# Altium schematic sheet CHARGER.SchDoc
size A4; SheetNumber: 4; SheetTotal: 7
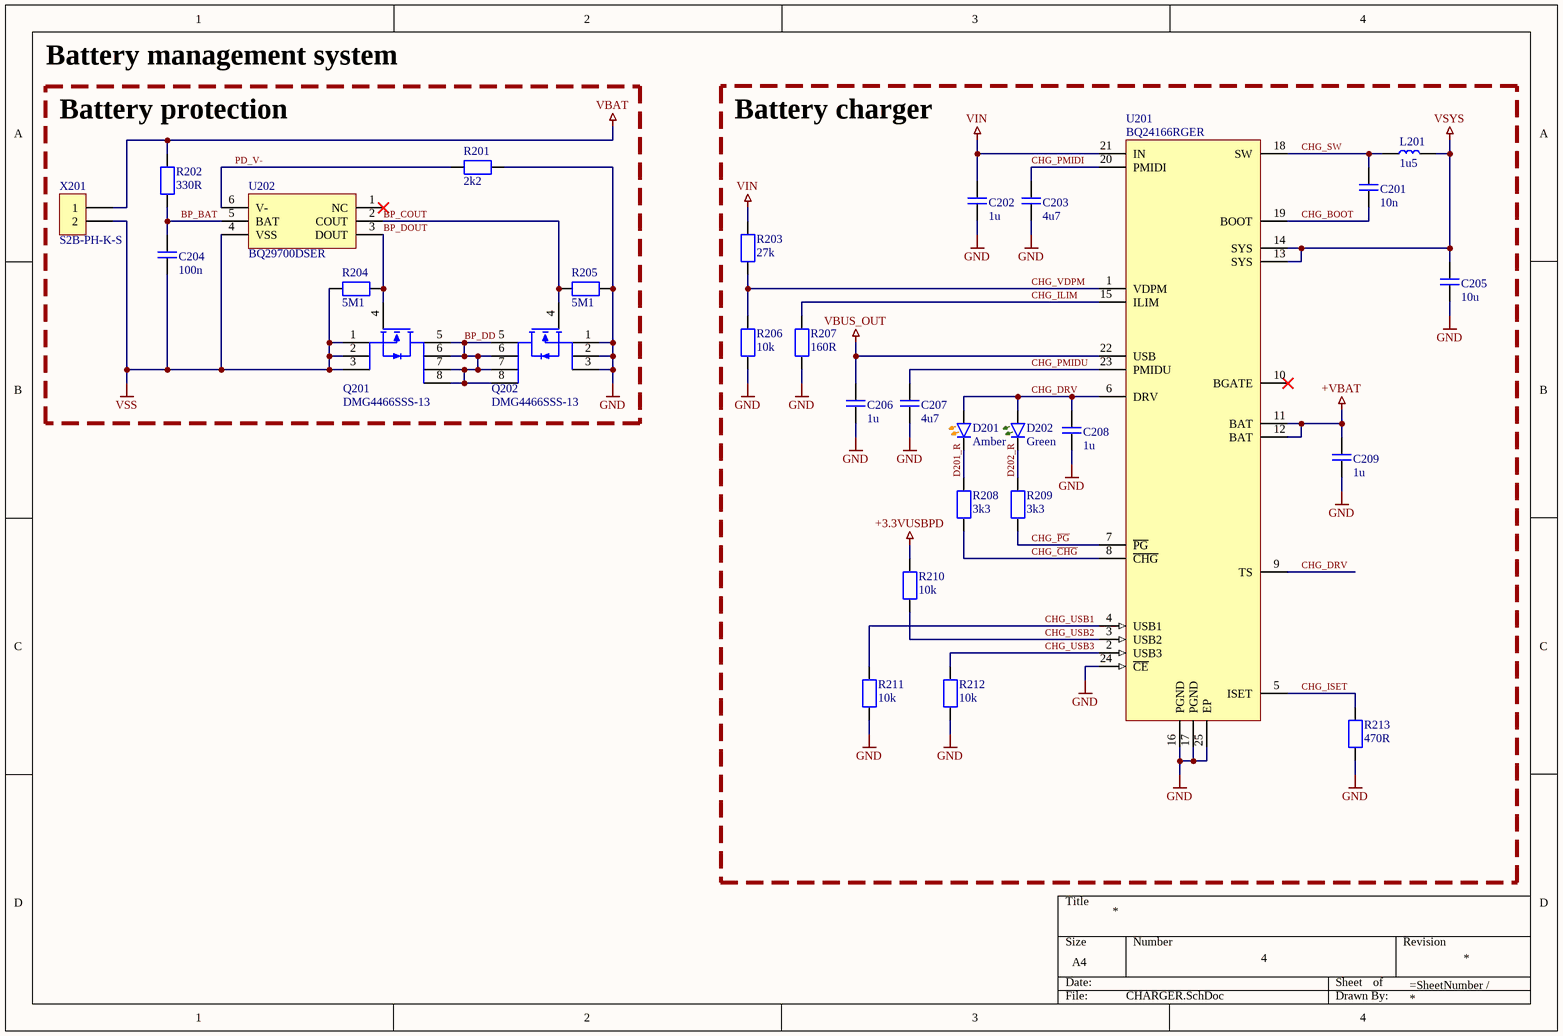
[diagram p0: CHARGER.SchDoc]

## Parts
C201  10n  [CAPC0603]
C202  1u  [CAPC0603]
C203  4u7  [CAPC0603]
C204  100n  [CAPC0603]
C205  10u  [CAPC0603]
C206  1u  [CAPC0603]
C207  4u7  [CAPC0603]
C208  1u  [CAPC0603]
C209  1u  [CAPC0603]
D201  Amber  [LED0603]
D202  Green  [LED0603]
L201  1u5  [INDC1008]
Q201  DMG4466SSS-13  [SOIC127P610X175-8]
Q202  DMG4466SSS-13  [SOIC127P610X175-8]
R201  2k2  [RESC0603]
R202  330R  [RESC0603]
R203  27k  [RESC0603]
R204  5M1  [RESC0603]
R205  5M1  [RESC0603]
R206  10k  [RESC0603]
R207  160R  [RESC0603]
R208  3k3  [RESC0603]
R209  3k3  [RESC0603]
R210  10k  [RESC0603]
R211  10k  [RESC0603]
R212  10k  [RESC0603]
R213  470R  [RESC0603]
U201  BQ24166RGER  [QFN50P410X410X100-24EP]
U202  BQ29700DSER  [WSON50P150X150X80-6]
X201  S2B-PH-K-S  [JST_S2B-PH-K-S]

## Blocks framed on the sheet
Battery charger: C201-C203 C205-C209 D201 D202 L201 R203 R206-R213 U201

## Nets
+3.3VUSBPD: R210.1
+VBAT: C209.2 U201.11(BAT) U201.12(BAT)
GND: C202.1 C203.1 C205.1 C206.1 C207.1 C208.1 C209.1 Q202.1(S) Q202.2(S) Q202.3(S) R201.1 R205.1 R206.1 R207.2 R211.2 R212.2 R213.1 U201.16(PGND) U201.17(PGND) U201.24(~{CE}) U201.25(EP)
VBAT: R202.2 X201.1
VBUS_OUT: C206.2 U201.22(USB)
VIN: C202.2 R203.2 U201.21(IN)
VSS: C204.1 Q201.1(S) Q201.2(S) Q201.3(S) R204.2 U202.4(VSS) X201.2
VSYS: C205.2 L201.2 U201.13(SYS) U201.14(SYS)
BP_BAT: C204.2 R202.1 U202.5(BAT)
BP_COUT: Q202.4(G) R205.2 U202.2(COUT)
BP_DD: Q201.5(D) Q201.6(D) Q201.7(D) Q201.8(D) Q202.5(D) Q202.6(D) Q202.7(D) Q202.8(D)
BP_DOUT: Q201.4(G) R204.1 U202.3(DOUT)
CHG_BOOT: C201.1 U201.19(BOOT)
CHG_~{CHG}: R208.1 U201.8(~{CHG})
CHG_DRV: C208.2 D201.2 D202.2 U201.6(DRV) U201.9(TS)
CHG_ILIM: R207.1 U201.15(ILIM)
CHG_ISET: R213.2 U201.5(ISET)
CHG_~{PG}: R209.1 U201.7(~{PG})
CHG_PMIDI: C203.2 U201.20(PMIDI)
CHG_PMIDU: C207.2 U201.23(PMIDU)
CHG_SW: C201.2 L201.1 U201.18(SW)
CHG_USB1: R211.1 U201.4(USB1)
CHG_USB2: R210.2 U201.3(USB2)
CHG_USB3: R212.1 U201.2(USB3)
CHG_VDPM: R203.1 R206.2 U201.1(VDPM)
D201_R: D201.1 R208.2
D202_R: D202.1 R209.2
PD_V-: R201.2 U202.6(V-)

Not connected (* = marked no-connect by the designer): U201 10(BGATE)*; U202 1(NC)*

## Notes on the sheet
- Battery management system
- (near R202) Battery protection

## Library data of the parts
C201 = CAPC0603-10n-20: Ceramic capacitor, 10nF,  50V, X7R; MFR: KEMET; MFRN: C0603C103K5RAC7081; SPN: 80-C0603C103K5R7081; Checked: Yes; Footprint: 0603; Supplier: Mouser; Link: https://hr.mouser.com/ProductDetail/KEMET/C0603C103K5RAC7081?qs=sSYV1F9c5cFnAwHdDYKUcw%3D%3D
C202 C206 C208 C209 = CAPC0603-1u-10: Ceramic capacitor, 1uF,  50V, X5R; MFR: Murata Electronics; MFRN: GRT188R61H105KE13D; SPN: 81-GRT188R61H105KE3D; Checked: Yes; Footprint: 0603; Supplier: Mouser; Link: https://hr.mouser.com/ProductDetail/Murata-Electronics/GRT188R61H105KE13D?qs=drgMNd%252BkGPNIxxtJByMGCg%3D%3D
C203 C207 = CAPC0603-4u7-10: Ceramic capacitor, 4.7uF, 25V, X5R; MFR: TDK; MFRN: C1608X5R1E475K080AC; SPN: 810-C1608X5R1E475K; Checked: Yes; Footprint: 0603; Supplier: Mouser; Link: https://hr.mouser.com/ProductDetail/TDK/C1608X5R1E475K080AC?qs=dfay7wIA1uHUGZGvnFtOyQ%3D%3D
C204 = CAPC0603-100n-10: Ceramic capacitor, 100nF,  50V, X7R; MFR: KEMET; MFRN: C0603C104K5RACAUTO; SPN: 80-C0603C104K5RAUTO; Checked: Yes; Footprint: 0603; Supplier: Mouser; Link: https://hr.mouser.com/ProductDetail/KEMET/C0603C104K5RACAUTO?qs=8xX%252BF9%252BWV6EZsgKw9G0PqQ%3D%3D
C205 = CAPC0603-10u-20: Ceramic capacitor, 10uF,  25V, X5R; MFR: TAIYO YUDEN; MFRN: TMK107BBJ106MA-T; SPN: 963-TMK107BBJ106MA-T; Checked: Yes; Footprint: 0603; Supplier: Mouser; Link: https://hr.mouser.com/ProductDetail/TAIYO-YUDEN/TMK107BBJ106MA-T?qs=lkMpTOwszhf2a50BCYsq8A%3D%3D
D201 = 150060AS75000: LED Amber, 2V, 30mA; MFR: Würth Elektronik; SPN: 710-150060AS75000; Checked: Yes; Footprint: 0603; Supplier: Mouser; MFRN: 150060AS75000; Link: https://hr.mouser.com/ProductDetail/Wurth-Elektronik/150060AS75000?qs=d0WKAl%252BL4KbvMBYryeof0Q%3D%3D
D202 = 150060GS75000: LED Green, 2.1V, 20mA; MFR: Wurth Elektronik; SPN: 710-150060GS75000; Checked: Yes; Footprint: 0603; Supplier: Mouser; MFRN: 150060GS75000; Link: https://hr.mouser.com/ProductDetail/Wurth-Elektronik/150060GS75000?qs=LlUlMxKIyB0UYkq5lDO8nA%3D%3D
L201 = INDC1008-1u5-20: Inductor 1.5uH, 3.3A, ±20%, 60mOhm; MFR: TDK; MFRN: TMS252012ALM-1R5MTAA; SPN: 810-TMS252012ALM1R5M; Checked: Yes; Footprint: 1008; Supplier: Mouser; Link: https://hr.mouser.com/ProductDetail/TDK/TMS252012ALM-1R5MTAA?qs=7MVldsJ5UayRLHp7atJZag%3D%3D
Q201 Q202 = DMG4466SSS-13: MOSFET, N-CH, 30V, 10A; MFR: Diodes Incorporated; SPN: 621-DMG4466SSS-13; Checked: Yes; Footprint: SOIC-8; Supplier: Mouser; MFRN: DMG4466SSS-13; Link: https://hr.mouser.com/ProductDetail/Diodes-Incorporated/DMG4466SSS-13?qs=sJ%252BpcIzCtBiZrDaWKxeDlA%3D%3D
R201 = RES0603-2k2-1: Thick film resistor, 2.2kOhms, 100mW; MFR: YAGEO; MFRN: RC0603FR-072K2L; SPN: 603-RC0603FR-072K2L; Checked: Yes; Footprint: 0603; Supplier: Mouser; Link: https://hr.mouser.com/ProductDetail/YAGEO/RC0603FR-072K2L?qs=diQw95jMAeOQmNpe2MM%252BPw%3D%3D
R202 = RES0603-330R-1: Thick film resistor, 330Ohms, 100mW; MFR: YAGEO; MFRN: RT0603FRE13330RL; SPN: 603-RT0603FRE13330RL; Checked: Yes; Footprint: 0603; Supplier: Mouser; Link: https://hr.mouser.com/ProductDetail/YAGEO/RT0603FRE13330RL?qs=sGAEpiMZZMtlubZbdhIBIMaxnMKvEBNdDzkYru5tzsM%3D
R203 = RES0603-27-1: Thick film resistor, 27kOhm, 100mW; MFR: YAGEO; MFRN: RC0603FR-0727KL; SPN: 603-RC0603FR-0727KL; Checked: Yes; Footprint: 0603; Supplier: Mouser; Link: https://hr.mouser.com/ProductDetail/YAGEO/RC0603FR-0727KL?qs=HhmREhdzqomUcJ5okwKG7g%3D%3D
R204 R205 = RES0603-5M1-1: Thick film resistor, 5.1MOhms, 100mW; MFR: YAGEO; MFRN: RC0603FR-075M1L; SPN: 603-RC0603FR-075M1L; Checked: Yes; Footprint: 0603; Supplier: Mouser; Link: https://hr.mouser.com/ProductDetail/YAGEO/RC0603FR-075M1L?qs=EiqXWrxQq62YzjenV3bCvA%3D%3D
R206 R210-R212 = RES0603-10k-1: Thick film resistor, 10kOhm, 100mW; MFR: YAGEO; MFRN: RC0603FR-1010KL; SPN: 603-RC0603FR-1010KL; Checked: Yes; Footprint: 0603; Supplier: Mouser; Link: https://hr.mouser.com/ProductDetail/YAGEO/RC0603FR-1010KL?qs=sGAEpiMZZMtlubZbdhIBIHvQf5egq9lvqRHakiGwa0o%3D
R207 = RES0603-160R-1: Thick film resistor, 160Ohms, 100mW; MFR: Panasonic; MFRN: ERJ-3EKF1600V; SPN: 667-ERJ-3EKF1600V; Checked: Yes; Footprint: 0603; Supplier: Mouser; Link: https://hr.mouser.com/ProductDetail/Panasonic/ERJ-3EKF1600V?qs=iBwFsHVUAOdeFCQ863k5IQ%3D%3D
R208 R209 = RES0603-3k3-1: Thick film resistor, 3.3kOhms, 100mW; MFR: YAGEO; MFRN: AC0603FR-073K3L; SPN: 603-AC0603FR-073K3L; Checked: Yes; Footprint: 0603; Supplier: Mouser; Link: https://hr.mouser.com/ProductDetail/YAGEO/AC0603FR-073K3L?qs=sGAEpiMZZMtlubZbdhIBINBo7nw4llFtjb1EiDJ1uvY%3D
R213 = RES0603-470R-1: Thick film resistor, 470R, 100mW; MFR: YAGEO; MFRN: RC0603FR-07470RL; SPN: 603-RC0603FR-07470RL; Checked: Yes; Footprint: 0603; Supplier: Mouser; Link: https://hr.mouser.com/ProductDetail/YAGEO/RC0603FR-07470RL?qs=gt6vzsuosg2Xv5elfMBXPA%3D%3D
U201 = IC BATT CHG LI-ION BQ24166: IC Battery Charger, Li-Ion, 1 Cell, 3.7V, 2.5A; MFR: Texas Instruments; SPN: 595-BQ24166RGER; Checked: Yes; Footprint: VQFN-24; Supplier: Mouser; MFRN: BQ24166RGER; Link: https://hr.mouser.com/ProductDetail/Texas-Instruments/BQ24166RGER?qs=63LrFSLv3u%252BNG%2F5wEYuQNQ%3D%3D
U202 = IC BATT PROT BQ29700DSER: Battery Protection IC Li-Ion 1Cell; MFR: Texas Instruments; SPN: 595-BQ29700DSER; Checked: Yes; Footprint: WSON-6; Supplier: Mouser; MFRN: BQ29700DSER; Link: https://hr.mouser.com/ProductDetail/Texas-Instruments/BQ29700DSER?qs=%2Fd%252BFzHvH4c3zNh7Hkm%2Fvbw%3D%3D
X201 = JST S2B-PH-K-S: JST PH Connector 2POS R/A THT; MFR: JST Sales America Inc.; SPN: 455-1719-ND; Checked: Yes; Supplier: Digi-Key; MFRN: S2B-PH-K-S; Link: https://www.digikey.com/en/products/detail/jst-sales-america-inc/S2B-PH-K-S/926626